# Altium schematic sheet Main.SchDoc
size A3; SheetNumber: 1; SheetTotal: 4
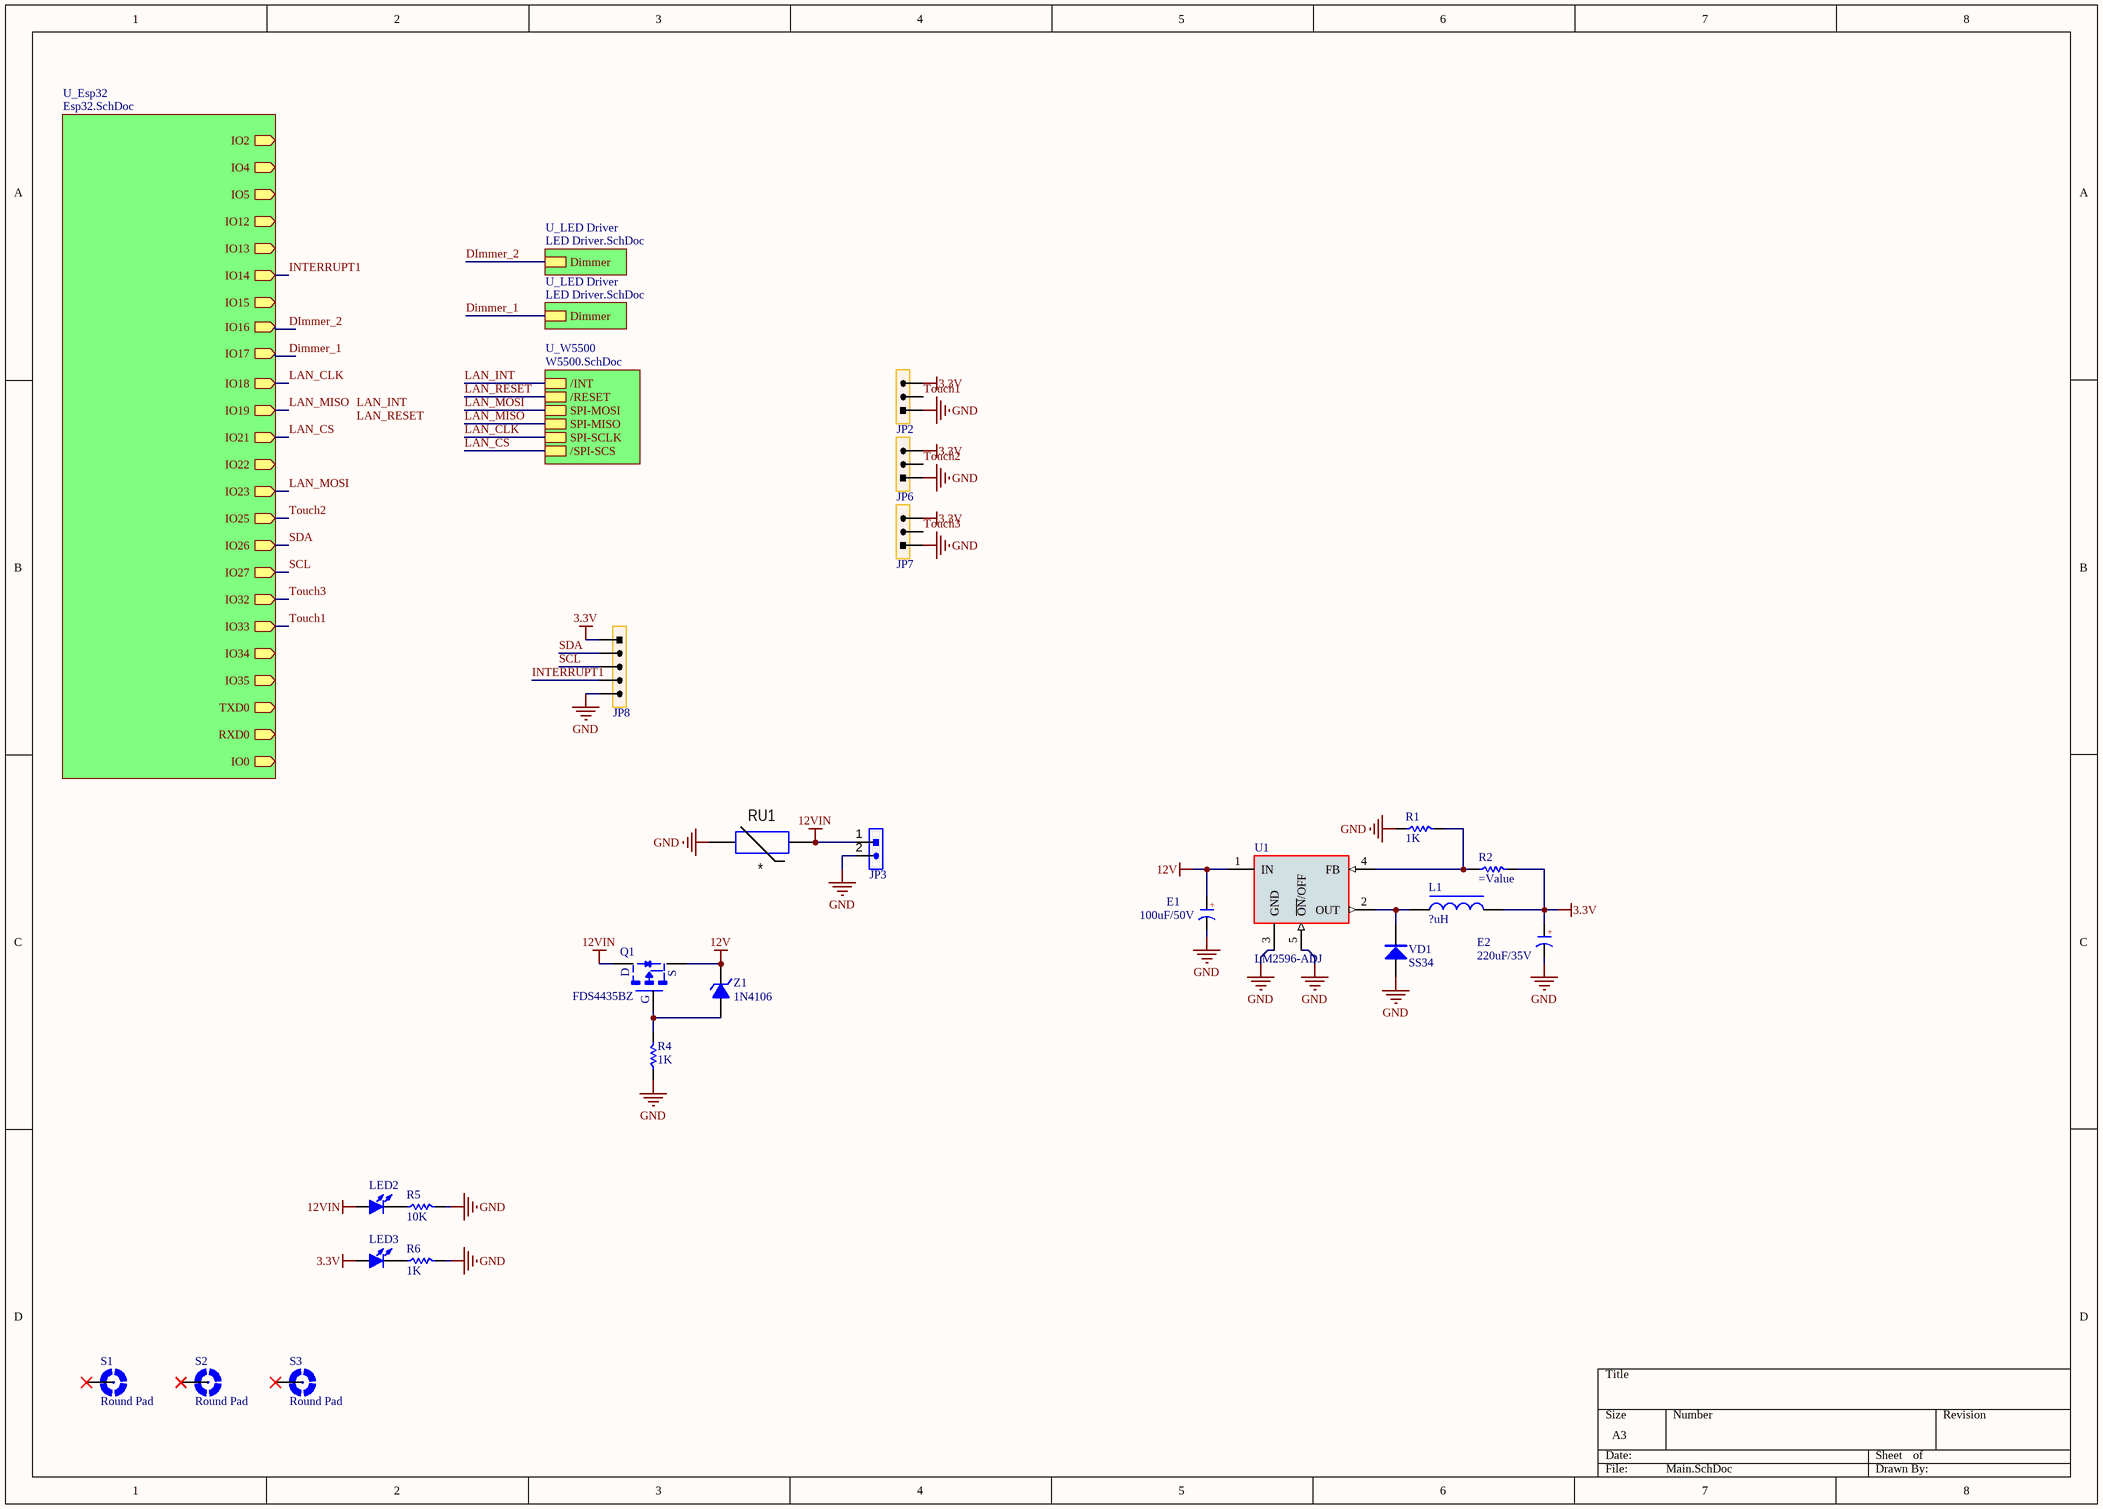
[diagram p0: Main.SchDoc]

## Parts
E1  100uF/50V  [CM E(8*10.2)]
E2  220uF/35V  [CM E(8*10.2)]
JP2  HDR-1X3  [XH2.54-3P_H]  (value not drawn)
JP3  HDR-1X2  [KF2EDGK-2P_H_7.62]  (value not drawn)
JP6  HDR-1X3  [XH2.54-3P_H]  (value not drawn)
JP7  HDR-1X3  [XH2.54-3P_H]  (value not drawn)
JP8  HDR-1X5  [XH2.54-5P_H]  (value not drawn)
L1  ?uH  [CDRH125]
LED2  LED-SMD  [LED 0805R]  (value not drawn)
LED3  LED-SMD  [LED 0805R]  (value not drawn)
Q1  FDS4435BZ  [SOP8-E3]
R1  1K  [R 0805]
R2  (no value)  [R 0805]
R4  1K  [R 0805]
R5  10K  [R 0805]
R6  1K  [R 0805]
RU1  *  [Varistor Short Hieght - Straight]
S1  Round Pad  [P3.0C]  (no BOM)
S2  Round Pad  [P3.0C]  (no BOM)
S3  Round Pad  [P3.0C]  (no BOM)
U1  LM2596-ADJ  [TO263-5A]
VD1  SS34  [SMA]
Z1  1N4106  [DO-213AA]

## Sub-sheets
U_Esp32 = Esp32.SchDoc: IO2 (out), IO4 (out), IO5 (out), IO12 (out), IO13 (out), IO14 (out), IO15 (out), IO16 (out), IO17 (out), IO18 (out), IO19 (out), IO21 (out), IO22 (out), IO23 (out), IO25 (out), IO26 (out), IO27 (out), IO32 (out), IO33 (out), IO34 (out), IO35 (out), TXD0 (out), RXD0 (out), IO0 (out)
U_LED Driver = LED Driver.SchDoc: Dimmer
U_LED Driver = LED Driver.SchDoc: Dimmer
U_W5500 = W5500.SchDoc: /INT, /RESET, SPI-MOSI, SPI-MISO, SPI-SCLK, /SPI-SCS

## Nets
3.3V: E2.1(A) JP2.3 JP6.3 JP7.3 JP8.1 L1.2 LED3.1(A) R2.2
12V: E1.1(A) Q1.1-3(S) U1.1(IN) Z1.2(K)
12VIN: JP3.1 LED2.1(A) Q1.5-8(D) RU1.2
GND: E1.2(K) E2.2(K) JP2.1 JP3.2 JP6.1 JP7.1 JP8.5 R1.1 R4.1 R5.2 R6.2 RU1.1 U1.3(GND) U1.5(~{ON}/OFF) VD1.1(A)
SHIELD: S1.P S2.P S3.P
Dimmer_1: sheet U_Esp32/IO17, sheet U_LED Driver/Dimmer
DImmer_2: sheet U_Esp32/IO16, sheet U_LED Driver/Dimmer
INTERRUPT1: JP8.4 ; sheet U_Esp32/IO14
LAN_CLK: sheet U_Esp32/IO18, sheet U_W5500/SPI-SCLK
LAN_CS: sheet U_Esp32/IO21, sheet U_W5500//SPI-SCS
LAN_INT: sheet U_W5500//INT
LAN_MISO: sheet U_Esp32/IO19, sheet U_W5500/SPI-MISO
LAN_MOSI: sheet U_Esp32/IO23, sheet U_W5500/SPI-MOSI
LAN_RESET: sheet U_W5500//RESET
SCL: JP8.3 ; sheet U_Esp32/IO27
SDA: JP8.2 ; sheet U_Esp32/IO26
Touch1: JP2.2 ; sheet U_Esp32/IO33
Touch2: JP6.2 ; sheet U_Esp32/IO25
Touch3: JP7.2 ; sheet U_Esp32/IO32
NetL1_1: L1.1 U1.2(OUT) VD1.2(K)
NetLED2_2: LED2.2(K) R5.1
NetLED3_2: LED3.2(K) R6.1
NetQ1_4: Q1.4(G) R4.2 Z1.1(A)
NetR1_2: R1.2 R2.1 U1.4(FB)

## Notes on the sheet
- Labels drawn without touching a wire or pin: LAN_INT, LAN_RESET
- (in symbol C-CM) +

## Library data of the parts
E1 E2 = C-CM: Chip electrolytic capacitor; BOM名称: 贴片电解电容; 版权归属: 源创客; 学习资源: www.ooocke.com
JP2 JP6 JP7 = Header 3: 3P Connector; BOM名称: 3P接插件; 版权归属: 源创客; 学习资源: www.ooocke.com
JP3 = Header 2: 2P Connector; BOM名称: 2P接插件; 版权归属: 源创客; 学习资源: www.ooocke.com
JP8 = Header 5: 5P Connector; BOM名称: 5P接插件; 版权归属: 源创客; 学习资源: www.ooocke.com
L1 = L-CDRH: Power shielded inductor; BOM名称: 功率屏蔽电感; 版权归属: 源创客; 学习资源: www.ooocke.com
LED2 LED3 = LED-SMD: Patch LED; BOM名称: 贴片LED; 版权归属: 源创客; 学习资源: www.ooocke.com
R1 R2 R4-R6 = R: Chip resistor; 版权归属: 源创客; BOM名称: Chip resistor; 学习资源: www.ooocke.com
RU1 = V: Versiror; Manufacturer: *; Model: *; HelpURL: *; ComponentKind: *; Value: *
S1-S3 = MOUNT-PAD-ROUND: MOUNTING PAD, round
U1 = LM2596: DC step-down chip; BOM名称: DC稳压芯片; 版权归属: 源创客; 学习资源: www.ooocke.com
VD1 = SS34: Schottky diodes; BOM名称: 肖特基二极管; 版权归属: 源创客; 属性: 40V/3A; 学习资源: www.ooocke.com
Z1 = 1N4106: 12V/0.5W voltage regulator; BOM名称: 12V/0.5W稳压管; 版权归属: 源创客; 学习资源: www.ooocke.com